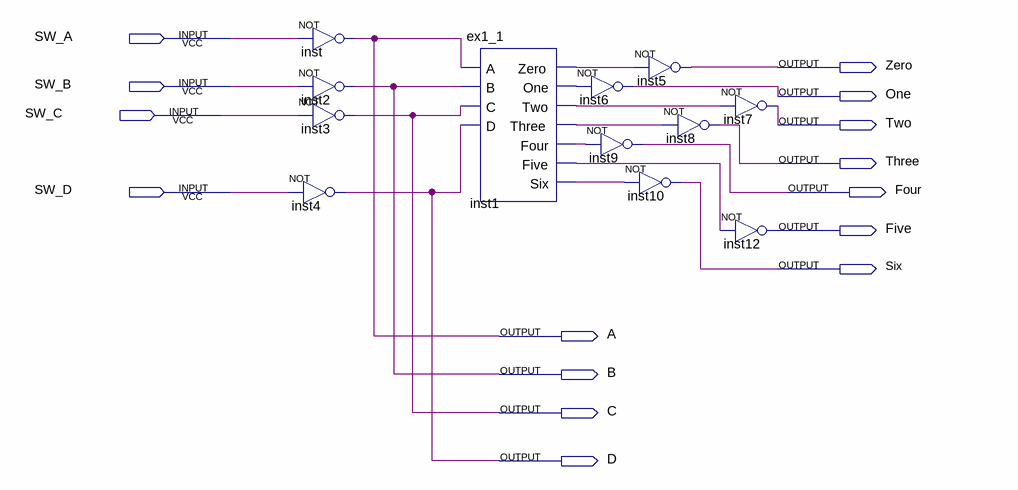
[diagram p0: schematic sheet]
// Quartus schematic interface.bdf as structural Verilog: 12 symbols, 15 pins
module \interface  (
  input  SW_A,
  input  SW_B,
  input  SW_C,
  input  SW_D,
  output Zero,
  output One,
  output Two,
  output Three,
  output Four,
  output Five,
  output Six,
  output A,
  output B,
  output C,
  output D
);

  wire inst1_five, inst1_four, inst1_one, inst1_six, inst1_three, inst1_two, inst1_zero;

  not inst (A, SW_A);
  not inst2 (B, SW_B);
  not inst3 (C, SW_C);
  not inst4 (D, SW_D);
  ex1_1 inst1 (
    .A(A), .B(B), .C(C), .D(D), .Zero(inst1_zero), .One(inst1_one), .Two(inst1_two), .Three(inst1_three),
    .Four(inst1_four), .Five(inst1_five), .Six(inst1_six));
  not inst6 (One, inst1_one);
  not inst5 (Zero, inst1_zero);
  not inst9 (Four, inst1_four);
  not inst10 (Six, inst1_six);
  not inst7 (Two, inst1_two);
  not inst8 (Three, inst1_three);
  not inst12 (Five, inst1_five);
endmodule
